# Altium schematic sheet CarteMere.SchDoc
size B; SheetNumber: 1; SheetTotal: 1; ENG_APP_DATE: --/--/--; DSN_APP_DATE: --/--/--; CHK_APP_DATE: --/--/--
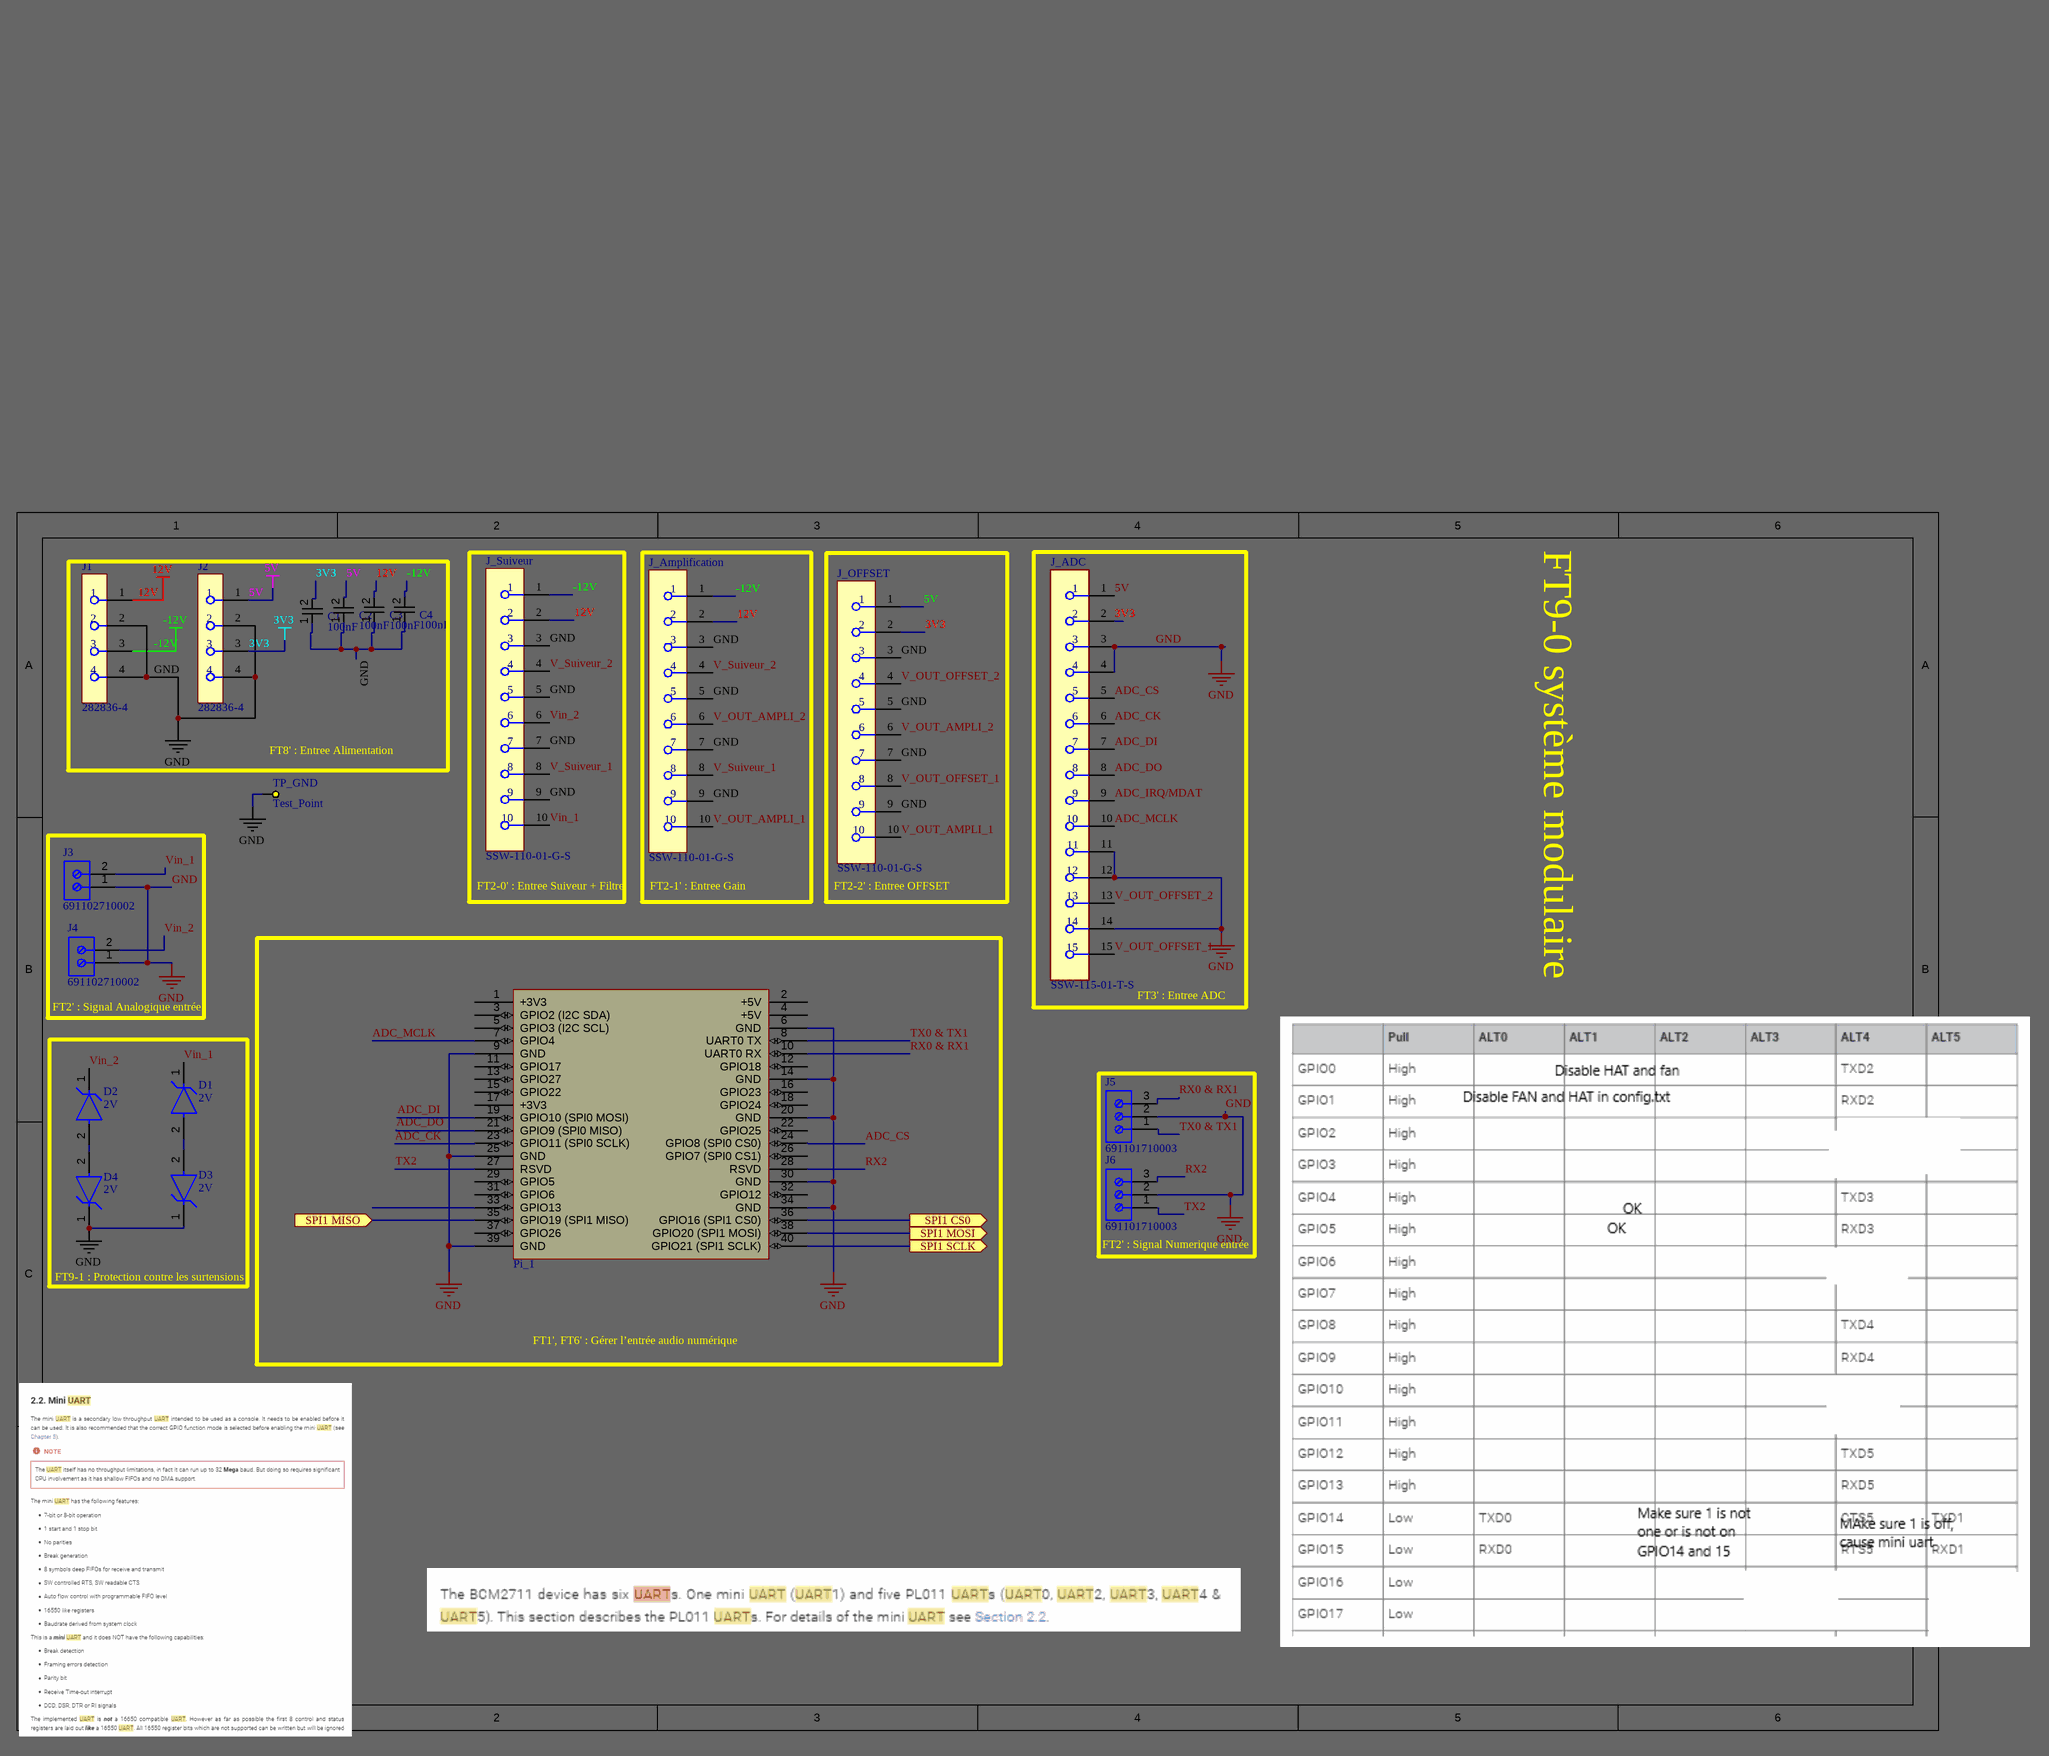
[diagram p0: CarteMere.SchDoc]

## Parts
C1  value 100nF  [Cap_6.0%2A2.5%2A6mm]  (hidden comment: Cap_6.0*2.5*6mm)
C2  value 100nF  [Cap_6.0%2A2.5%2A6mm]  (hidden comment: Cap_6.0*2.5*6mm)
C3  value 100nF  [Cap_6.0%2A2.5%2A6mm]  (hidden comment: Cap_6.0*2.5*6mm)
C4  value 100nF  [Cap_6.0%2A2.5%2A6mm]  (hidden comment: Cap_6.0*2.5*6mm)
D1  value 2V  [Zener_Diode]  (hidden comment: ZENER_Diode)
D2  value 2V  [Zener_Diode]  (hidden comment: ZENER_Diode)
D3  value 2V  [Zener_Diode]  (hidden comment: ZENER_Diode)
D4  value 2V  [Zener_Diode]  (hidden comment: ZENER_Diode)
J1  282836-4  [FP-282836-4-MFG]
J2  282836-4  [FP-282836-4-MFG]
J3  691102710002  [691102710002]
J4  691102710002  [691102710002]
J5  691101710003  [691101710003]
J6  691101710003  [691101710003]
J_ADC  SSW-115-01-T-S  [FP-SSW-115-01-T-S-MFG]
J_Amplification  SSW-110-01-G-S  [FP-SSW-110-01-G-S-MFG]
J_OFFSET  SSW-110-01-G-S  [FP-SSW-110-01-G-S-MFG]
J_Suiveur  SSW-110-01-G-S  [FP-SSW-110-01-G-S-MFG]
Pi_1  GPIO_conn_RaspberyPi  [Pi_20x2_pins_Male]  (value not drawn)
TP_GND  Test_Point  [Test_Point_Hook]

## Blocks framed on the sheet
FT8' : Entree Alimentation: C1-C4 J1 J2
FT2-0' : Entree Suiveur + Filtre: J_Suiveur
FT2-1' : Entree Gain: J_Amplification
FT2-2' : Entree OFFSET: J_OFFSET
FT3' : Entree ADC: J_ADC
FT2' : Signal Analogique entrée: J3 J4
FT1', FT6' : Gérer l’entrée audio numérique: Pi_1
FT9-1 : Protection contre les surtensions: D1-D4
FT2' : Signal Numerique entrée: J5 J6

## Ports
SPI1 CS0 (out), SPI1 MISO (in), SPI1 MOSI (out), SPI1 SCLK (out)

## Nets
3V3: C1.2 J2.3 J_ADC.2 J_OFFSET.2
5V: C2.2 J2.1 J_ADC.1 J_OFFSET.1
12V: C3.2 J1.1 J_Amplification.2 J_Suiveur.2
-12V: C4.2 J1.3 J_Amplification.1 J_Suiveur.1
GND: C1.1 C2.1 C3.1 C4.1 D3.1(C) D4.1(C) J1.2 J1.4 J2.2 J2.4 J3.1 J4.1 J5.2 J6.2 J_ADC.3 J_ADC.4 J_ADC.11 J_ADC.12 J_ADC.14 J_Amplification.3 J_Amplification.5 J_Amplification.7 J_Amplification.9 J_OFFSET.3 J_OFFSET.5 J_OFFSET.7 J_OFFSET.9 J_Suiveur.3 J_Suiveur.5 J_Suiveur.7 J_Suiveur.9 Pi_1.6(GND) Pi_1.9(GND) Pi_1.14(GND) Pi_1.20(GND) Pi_1.25(GND) Pi_1.30(GND) Pi_1.34(GND) Pi_1.39(GND) TP_GND.Tp?
ADC_CK: J_ADC.6 Pi_1.23(GPIO11_(SPI0_SCLK))
ADC_CS: J_ADC.5 Pi_1.24(GPIO8_(SPI0_CS0))
ADC_DI: J_ADC.7 Pi_1.19(GPIO10_(SPI0_MOSI))
ADC_DO: J_ADC.8 Pi_1.21(GPIO9_(SPI0_MISO))
ADC_IRQ/MDAT: J_ADC.9
ADC_MCLK: J_ADC.10 Pi_1.7(GPIO4)
RX0 & RX1: J5.3 Pi_1.10(UART0_RX)
RX2: J6.3 Pi_1.28(RSVD)
SPI1 CS0: Pi_1.36(GPIO16_(SPI1_CS0)) ; port SPI1 CS0
SPI1 MISO: Pi_1.35(GPIO19_(SPI1_MISO)) ; port SPI1 MISO
SPI1 MOSI: Pi_1.38(GPIO20_(SPI1_MOSI)) ; port SPI1 MOSI
SPI1 SCLK: Pi_1.40(GPIO21_(SPI1_SCLK)) ; port SPI1 SCLK
TX0 & TX1: J5.1 Pi_1.8(UART0_TX)
TX2: J6.1 Pi_1.27(RSVD)
V_OUT_AMPLI_1: J_Amplification.10 J_OFFSET.10
V_OUT_AMPLI_2: J_Amplification.6 J_OFFSET.6
V_OUT_OFFSET_1: J_ADC.15 J_OFFSET.8
V_OUT_OFFSET_2: J_ADC.13 J_OFFSET.4
V_Suiveur_1: J_Amplification.8 J_Suiveur.8
V_Suiveur_2: J_Amplification.4 J_Suiveur.4
Vin_1: D1.1(C) J3.2 J_Suiveur.10
Vin_2: D2.1(C) J4.2 J_Suiveur.6
NetD1_2: D1.2(A) D3.2(A)
NetD2_2: D2.2(A) D4.2(A)

Not connected (* = marked no-connect by the designer): Pi_1 1(+3V3) 2(+5V) 3(GPIO2_(I2C_SDA)) 4(+5V) 5(GPIO3_(I2C_SCL)) 11(GPIO17) 12(GPIO18) 13(GPIO27) 15(GPIO22) 16(GPIO23) 17(+3V3) 18(GPIO24) 22(GPIO25) 26(GPIO7_(SPI0_CS1)) 29(GPIO5) 31(GPIO6) 32(GPIO12) 33(GPIO13) 37(GPIO26)

## Notes on the sheet
- FT9-0 système modulaire
- DWG. NO.
- REV.
- SHT.
- THIS DOCUMENT AND THE DATA DISCLOSED HEREIN OR HEREWITH IS THE PROPERTY OF ALTIUM LIMITED AND MAY BE FREELY DISTRIBUTED IN WHOLE. NO RIGHTS ARE RESERVED OR EXPRESS OR IMPLIED WARANTEE GIVEN.
- REVISION
- DESCRIPTION
- DATE
- APPROVED
- ENG:
- APPROVALS
- PROJECT
- DSN:
- CHK:
- REFERENCE DOCUMENTS
- PROJECT REVISION:
- TITLE
- DOCUMENT REVISION:
- DESIGN ITEM:
- BOM:
- FAB DWG:
- PCB DWG:
- ASSY DWG:
- SCALE:
- SIZE
- B
- CAGE CODE
- FILE NAME
- DWG NO.
- SHEET
- OF
- REV

## Library data of the parts
J1 J2 = CMP-03790-46505329-1: 282836-4 Connector, Terminal Block; Wire Receptacle; 4 Pos.; 16-30 AWG; 0.197 in. CL; Sid; Manufacturer Lifecycle Status: ACTIVE; Number of Contacts: 4; Max Supply Voltage (AC): 300V; Wire Gauge (Min): 30AWG; Max Current Rating: 13.5A; Approvals: UL; Number of Levels: 1; Thread Size: M3; Connector System: Wire-to-Board; Voltage Rating (DC): 250V; Pitch: 5mm; Plating: Brass; Tail Length: 3.5mm; Housing Color: Green; Number of Rows: 1; REACH SVHC: Unknown; Lead Pitch: 5mm; Depth: 8.2mm; Lead Free: Lead Free; Mount: Through Hole; Contact Plating: Tin; Housing Material: Polyamide; ELV: Compliant; Radiation Hardening: No; RoHS: Compliant; Number of Circuits: 4; Voltage Rating: 300V; Contact Material: Brass; NexarPartId: 46505329; Current Rating: 13.5A; Max Voltage Rating (AC): 300V; Orientation: Straight; Number of Positions: 4; Lifecycle Status: Production; Operating Supply Voltage: 300V; Connector Type: Receptacle; Number of Positions Per Level: 4; Flammability Rating: UL94 V-0; Packaging: Bulk; Termination: Screw, Solder; Wire Gauge (Max): 30AWG; Number of Poles: 4; Width: 10mm; Voltage Rating (AC): 250V; Length: 20mm; Current: 13.5A; Voltage: 300V; Color: Green
J3 J4 = CMP-1502-03258-2: NexarPartId: 8917706; Number of Levels: 1; Number of Positions Per Level: 2; Current: 15A; Voltage: 300V; Pitch: 5.0038mm; Plating: Steel; Stripping Length: -6mm; Wire Gauge (Min): 14AWG; Wire Gauge (Max): 22AWG; Length: 7.5mm; Contact Material: Brass; Contact Plating: Tin; Packaging: Box; Number of Pins: 2; Voltage Rating: 300V; Termination: Screw; Number of Contacts: 2; Color: Blue; Current Rating: 15A; Mount: Through Hole; Max Operating Temperature: 105°C; Min Operating Temperature: -40°C; REACH SVHC: Unknown; Height: 13.4mm; Width: 11.2mm; Housing Material: Nylon; RoHS: Compliant; Wire/Cable Gauge: 22AWG; Lead Pitch: 5mm
J5 J6 = CMP-1502-03257-2: NexarPartId: 8917705; Voltage Rating: 250V; Current: 16A; Wire Gauge (Min): 14AWG; Pitch: 5.0038mm; Wire Gauge (Max): 26AWG; Number of Positions Per Level: 3; Plating: Steel; Number of Levels: 1; Stripping Length: -7mm; REACH SVHC: Unknown; Width: 16.2mm; Height: 16.4mm; Contact Material: Brass; RoHS: Compliant; Color: Blue; Contact Plating: Tin; Lead Pitch: 5mm; Packaging: Box; Termination: Screw; Number of Contacts: 3; Wire/Cable Gauge: 26AWG; Min Operating Temperature: -40°C; Max Operating Temperature: 105°C; Housing Material: Nylon; Length: 9mm; Voltage: 250V; Mount: Through Hole; Current Rating: 16A; Number of Pins: 3
J_ADC = CMP-02766-001723-1: CONN RCPT 15POS 0.1 TIN PCB; Connector Type: Receptacle; Max Voltage Rating (AC): 550V; Mating Cycles: 100; Number of Positions: 15; Pitch: 0.1inch; Max Current Rating: 6.9A; Contact Resistance: 10mR; System: Connector; Contact Type: Female Socket; Color: Black; Depth: 2.41mm; Radiation Hardening: No; Orientation: Straight; Termination: Solder; Series: SSW; Lead Free: Lead Free; Min Operating Temperature: -55°C; Contact Plating: Tin; Contact Material: Bronze; Max Operating Temperature: 105°C; Mount: Through Hole; Packaging: Bulk; Gender: Receptacle; Housing Material: Polymer; RoHS Compliant: Yes; Length: 38.61mm; Number of Rows: 1; REACH SVHC: No SVHC; Width: 2.41mm; Number of Contacts: 15; Housing Color: Black
J_Amplification J_OFFSET J_Suiveur = CMP-1272-00002-2: Manufacturer Lifecycle Status: PRODUCTION; NexarPartId: 296065; Gender: Receptacle; Number of Contacts: 10; Contact Resistance: 10mΩ; Voltage Rating (AC): 465V; Connector Type: Socket; Voltage Rating: 550V; Voltage Rating (DC): 655V; Pitch: 2.54mm; Max Current Rating: 6.9A; Lead Length: 2.64mm; System: Connector; Depth: 2.41mm; Termination: Solder; Contact Material: Bronze; Length: 25.91mm; REACH SVHC: No SVHC; Min Operating Temperature: -55°C; Max Voltage Rating (AC): 550V; Color: Black; Lead Pitch: 2.54mm; Packaging: Bulk; Lead Free: Lead Free; Orientation: Vertical; Housing Color: Black; Lifecycle Status: Production; Contact Plating: Gold; Radiation Hardening: No; Current Rating: 6.9A; Number of Positions: 10; Max Operating Temperature: 125°C; Number of Rows: 1; RoHS: Compliant
Pi_1 = GPIO_conn_RaspberyPi: System: Connector